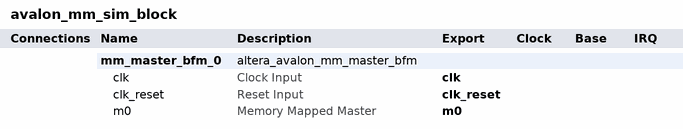
[diagram p0: system contents]
# Platform Designer (Qsys) system avalon_mm_sim_block, Cyclone IV E EP4CE22F17C6
# Parameters at their usual value, and those the tool derives, are not listed.
package require -exact qsys 15.0
create_system avalon_mm_sim_block
set_project_property DEVICE_FAMILY {Cyclone IV E}
set_project_property DEVICE EP4CE22F17C6

add_instance mm_master_bfm_0 altera_avalon_mm_master_bfm 15.0
set_instance_property mm_master_bfm_0 AUTO_EXPORT true
set_instance_parameter_value mm_master_bfm_0 ADDRESS_UNITS WORDS
set_instance_parameter_value mm_master_bfm_0 AV_ADDRESS_W 32
set_instance_parameter_value mm_master_bfm_0 AV_ALWAYS_BURST_MAX_BURST 0
set_instance_parameter_value mm_master_bfm_0 AV_BURSTCOUNT_W 1
set_instance_parameter_value mm_master_bfm_0 AV_BURST_BNDR_ONLY 1
set_instance_parameter_value mm_master_bfm_0 AV_BURST_LINEWRAP 1
set_instance_parameter_value mm_master_bfm_0 AV_CONSTANT_BURST_BEHAVIOR 1
set_instance_parameter_value mm_master_bfm_0 AV_FIX_READ_LATENCY 1
set_instance_parameter_value mm_master_bfm_0 AV_MAX_PENDING_WRITES 0
set_instance_parameter_value mm_master_bfm_0 AV_NUMSYMBOLS 4
set_instance_parameter_value mm_master_bfm_0 AV_READRESPONSE_W 8
set_instance_parameter_value mm_master_bfm_0 AV_READ_WAIT_TIME 1
set_instance_parameter_value mm_master_bfm_0 AV_WRITERESPONSE_W 8
set_instance_parameter_value mm_master_bfm_0 USE_BURSTCOUNT 0
set_instance_parameter_value mm_master_bfm_0 USE_BYTE_ENABLE 0
set_instance_parameter_value mm_master_bfm_0 USE_READ 1
set_instance_parameter_value mm_master_bfm_0 USE_READ_DATA 1
set_instance_parameter_value mm_master_bfm_0 USE_READ_DATA_VALID 1
set_instance_parameter_value mm_master_bfm_0 USE_WAIT_REQUEST 1
set_instance_parameter_value mm_master_bfm_0 VHDL_ID 0

# exported interfaces
add_interface clk clock sink
set_interface_property clk EXPORT_OF mm_master_bfm_0.clk
add_interface clk_reset reset sink
set_interface_property clk_reset EXPORT_OF mm_master_bfm_0.clk_reset
add_interface m0 avalon master
set_interface_property m0 EXPORT_OF mm_master_bfm_0.m0

set_interconnect_requirement {$system} qsys_mm.clockCrossingAdapter HANDSHAKE
set_interconnect_requirement {$system} qsys_mm.enableEccProtection FALSE
set_interconnect_requirement {$system} qsys_mm.insertDefaultSlave FALSE
set_interconnect_requirement {$system} qsys_mm.maxAdditionalLatency 1

save_system avalon_mm_sim_block.qsys
